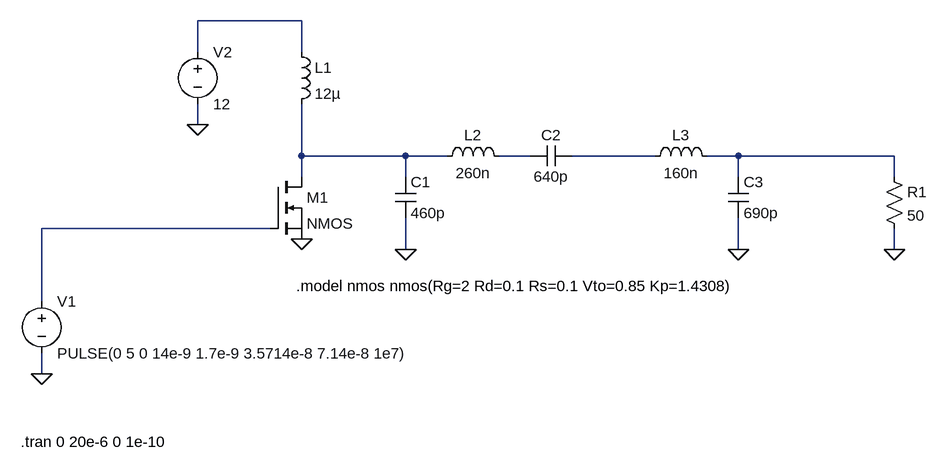
[diagram p0: schematic class_e_amp_14MHz.asc]
class_e_amp_14MHz.asc, the LTspice schematic file:
Version 4
SHEET 1 1480 680
WIRE 240 -96 80 -96
WIRE 80 -48 80 -96
WIRE 240 -48 240 -96
WIRE 80 64 80 32
WIRE 240 112 240 32
WIRE 400 112 240 112
WIRE 464 112 400 112
WIRE 592 112 544 112
WIRE 784 112 656 112
WIRE 912 112 864 112
WIRE 1152 112 912 112
WIRE 240 144 240 112
WIRE 400 144 400 112
WIRE 912 144 912 112
WIRE 1152 144 1152 112
WIRE 192 224 -160 224
WIRE 400 256 400 208
WIRE 912 256 912 208
WIRE 1152 256 1152 224
WIRE -160 336 -160 224
WIRE -160 448 -160 416
FLAG 240 240 0
FLAG -160 448 0
FLAG 80 64 0
FLAG 400 256 0
FLAG 1152 256 0
FLAG 912 256 0
SYMBOL nmos 192 144 R0
SYMATTR InstName M1
SYMBOL voltage -160 320 R0
WINDOW 123 0 0 Left 0
WINDOW 39 0 0 Left 0
SYMATTR InstName V1
SYMATTR Value PULSE(0 5 0 14e-9 1.7e-9 3.5714e-8 7.14e-8 1e7)
SYMBOL ind 224 -64 R0
SYMATTR InstName L1
SYMATTR Value 12µ
SYMATTR SpiceLine Ipk=2 Rser=1
SYMBOL voltage 80 -64 R0
WINDOW 123 0 0 Left 0
WINDOW 39 0 0 Left 0
SYMATTR InstName V2
SYMATTR Value 12
SYMBOL cap 384 144 R0
SYMATTR InstName C1
SYMATTR Value 460p
SYMBOL cap 656 96 R90
WINDOW 0 0 32 VBottom 2
WINDOW 3 32 32 VTop 2
SYMATTR InstName C2
SYMATTR Value 640p
SYMBOL ind 448 128 R270
WINDOW 0 32 56 VTop 2
WINDOW 3 5 56 VBottom 2
SYMATTR InstName L2
SYMATTR Value 260n
SYMBOL ind 768 128 R270
WINDOW 0 32 56 VTop 2
WINDOW 3 5 56 VBottom 2
SYMATTR InstName L3
SYMATTR Value 160n
SYMBOL cap 896 144 R0
SYMATTR InstName C3
SYMATTR Value 690p
SYMBOL res 1136 128 R0
SYMATTR InstName R1
SYMATTR Value 50
TEXT 232 312 Left 2 !.model nmos nmos(Rg=2 Rd=0.1 Rs=0.1 Vto=0.85 Kp=1.4308)
TEXT -192 552 Left 2 !.tran 0 20e-6 0 1e-10

The netlist it stands for:
* class_e_amp_14MHz.asc
M1 N002 N006 0 0 NMOS
V1 N006 0 PULSE(0 5 0 14e-9 1.7e-9 3.5714e-8 7.14e-8 1e7)
L1 N001 N002 12µ Ipk=2 Rser=1
V2 N001 0 12
C1 N002 0 460p
C2 N004 N003 640p
L2 N002 N003 260n
L3 N004 N005 160n
C3 N005 0 690p
R1 N005 0 50
.model NMOS NMOS
.model PMOS PMOS
.lib standard.mos
.model nmos nmos(Rg=2 Rd=0.1 Rs=0.1 Vto=0.85 Kp=1.4308)
.tran 0 20e-6 0 1e-10
.backanno
.end